# EAGLE design Guitar Hero Controller PS2 to PC PCB (EAGLE 9.2.0)
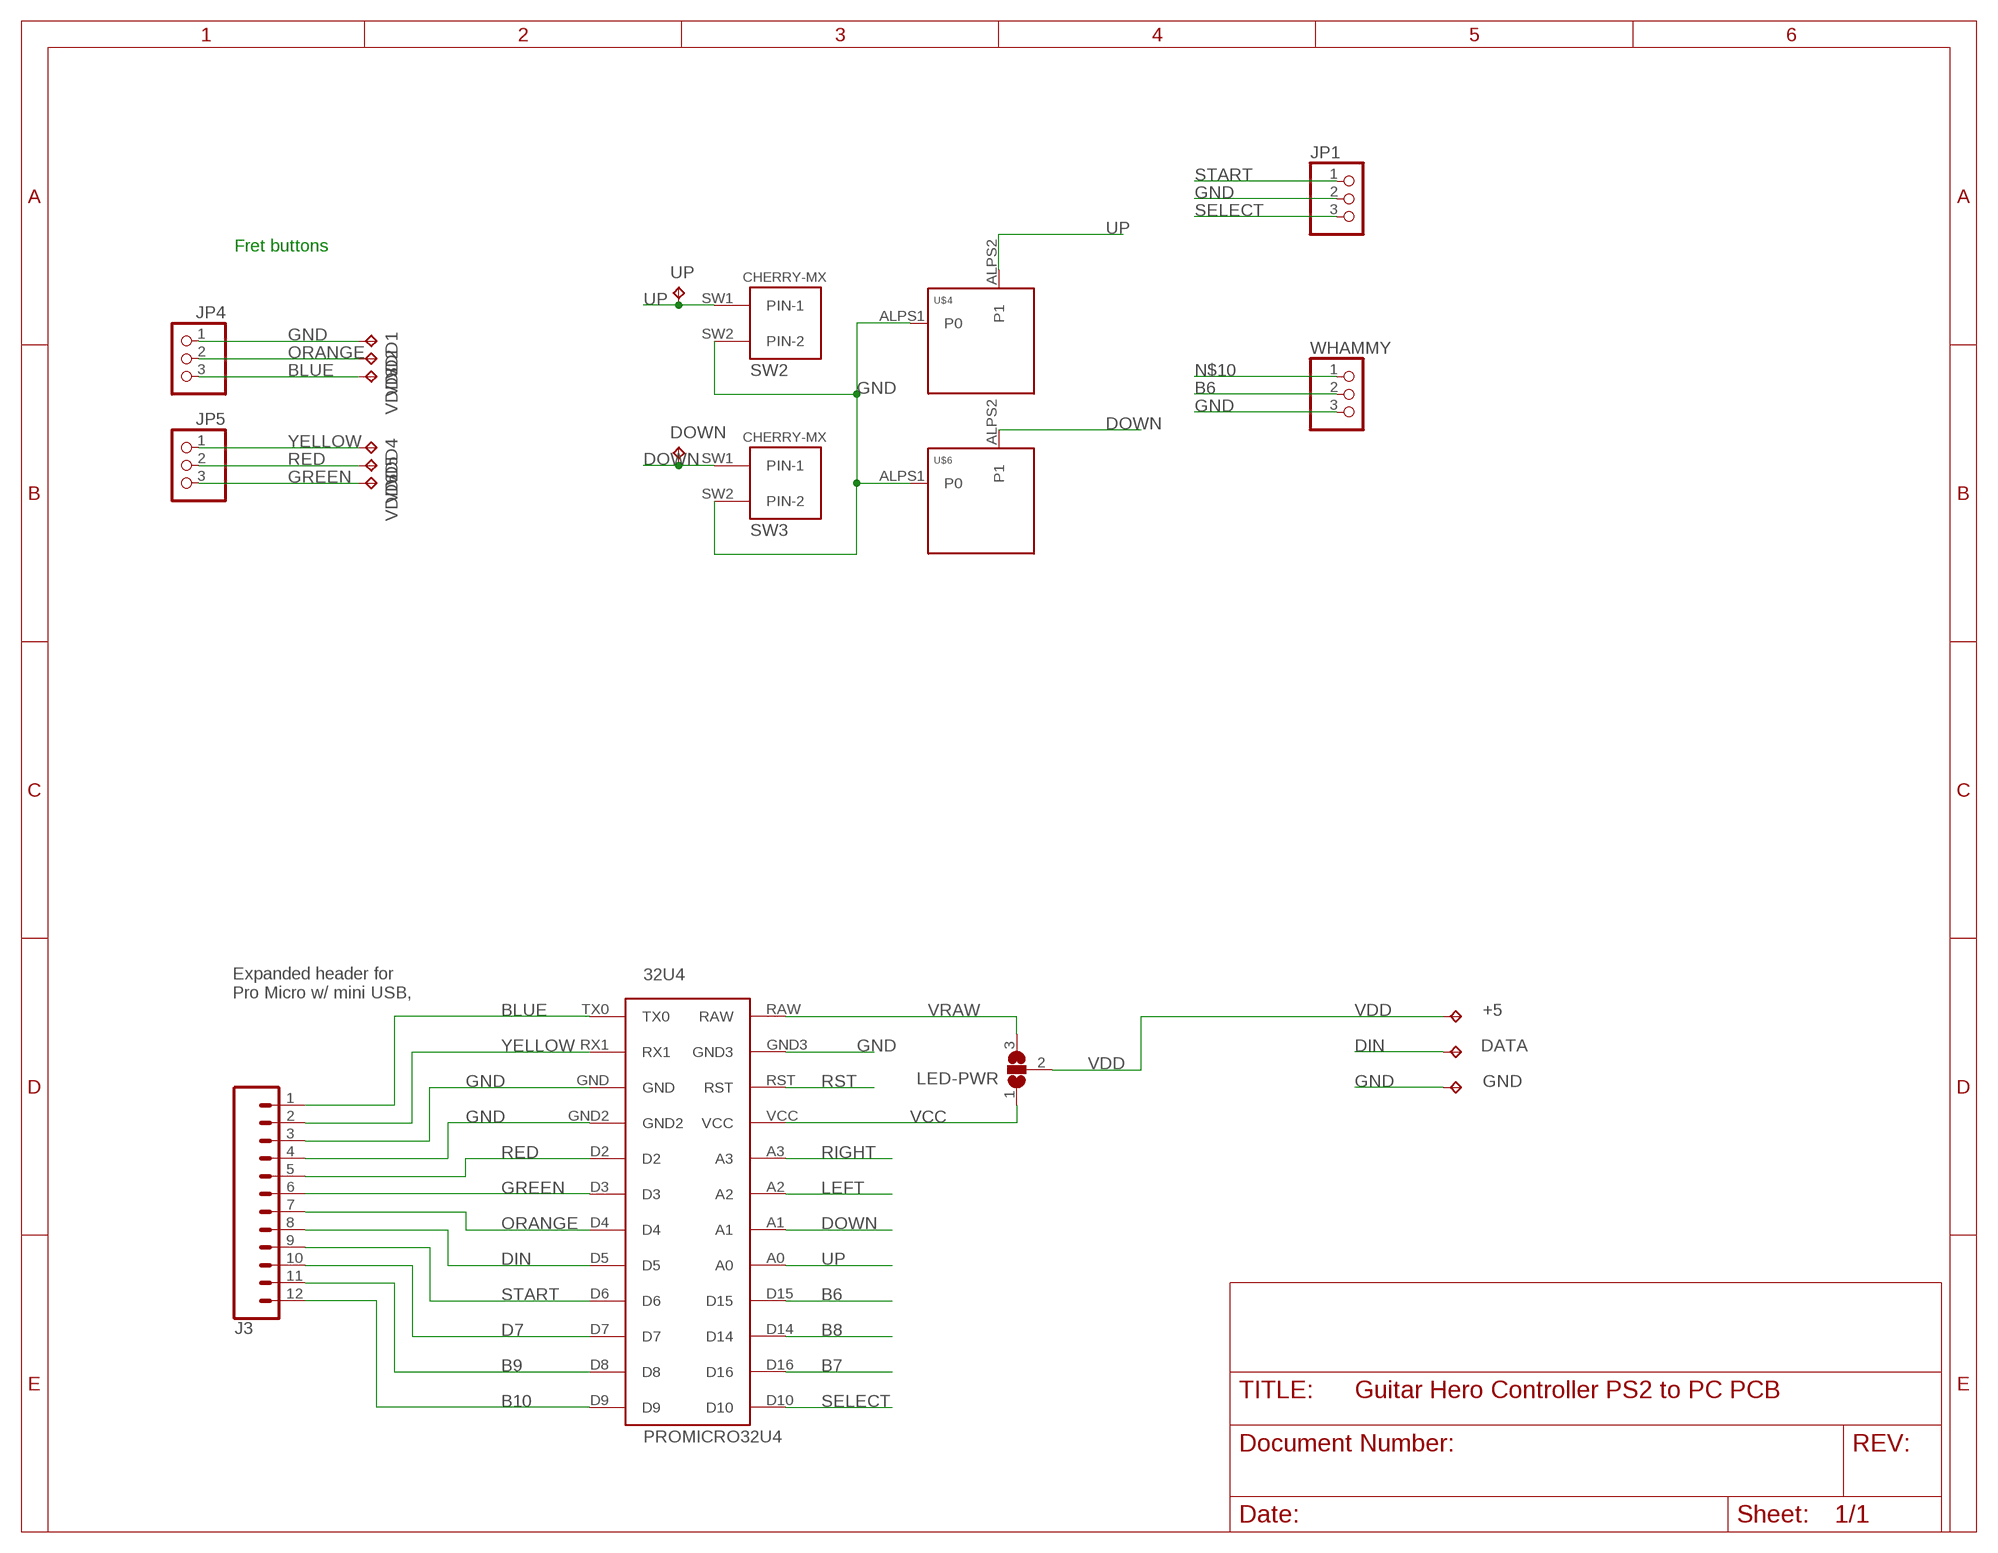
[diagram p0: schematic, sheet 1]

## Parts
32U4  PROMICRO32U4  [PROMICRO32U4]
+5  TPTP20SQ  [TP20SQ]
DATA  TPTP20SQ  [TP20SQ]
DOWN  TPTP20R  [TP20R]
GND  TPTP20SQ  [TP20SQ]
J3  CONN_12NO_SILK  [1X12_NO_SILK]
JP1  PINHD-1X3CB  [1X03-CLEANBIG]
JP4  PINHD-1X3CB  [1X03-CLEANBIG]
JP5  PINHD-1X3CB  [1X03-CLEANBIG]
LED-PWR  SJ2W  [SJ_2]
SW2  CHERRY-MX  [CHERRY-MX]
SW3  CHERRY-MX  [CHERRY-MX]
U$4  KEYSWITCH-PLAIN-ALPS-1U  [ALPS-1U]
U$6  KEYSWITCH-PLAIN-ALPS-1U  [ALPS-1U]
UP  TPTP20R  [TP20R]
VDD1  TPTP20SQ  [TP20SQ]
VDD2  TPTP20SQ  [TP20SQ]
VDD3  TPTP20SQ  [TP20SQ]
VDD4  TPTP20SQ  [TP20SQ]
VDD5  TPTP20SQ  [TP20SQ]
VDD6  TPTP20SQ  [TP20SQ]
WHAMMY  PINHD-1X3CB  [1X03-CLEANBIG]

## Nets
B6: 32U4.D15 WHAMMY.2
B7: 32U4.D16
B8: 32U4.D14
B9: 32U4.D8 J3.11
B10: 32U4.D9 J3.12
BLUE: 32U4.TX0 J3.1 JP4.3 VDD3.TP
D7: 32U4.D7 J3.10
DIN: 32U4.D5 DATA.TP J3.8
DOWN: 32U4.A1 DOWN.TP SW3.SW1(PIN-1) U$6.ALPS2(P1)
GND: 32U4.GND 32U4.GND2 32U4.GND3 GND.TP J3.3 J3.4 JP1.2 JP4.1 SW2.SW2(PIN-2) SW3.SW2(PIN-2) U$4.ALPS1(P0) U$6.ALPS1(P0) VDD1.TP WHAMMY.3
GREEN: 32U4.D3 J3.6 JP5.3 VDD6.TP
LEFT: 32U4.A2
N$10: WHAMMY.1
ORANGE: 32U4.D4 J3.7 JP4.2 VDD2.TP
RED: 32U4.D2 J3.5 JP5.2 VDD5.TP
RIGHT: 32U4.A3
RST: 32U4.RST
SELECT: 32U4.D10 JP1.3
START: 32U4.D6 J3.9 JP1.1
UP: 32U4.A0 SW2.SW1(PIN-1) U$4.ALPS2(P1) UP.TP
VCC: 32U4.VCC LED-PWR.1
VDD: +5.TP LED-PWR.2
VRAW: 32U4.RAW LED-PWR.3
YELLOW: 32U4.RX1 J3.2 JP5.1 VDD4.TP

## Notes on the sheet
- Fret buttons
- Expanded header for 
  Pro Micro w/ mini USB,

## Library data of the parts
32U4 = Pro-micro32u4:PROMICRO32U4
+5 DATA DOWN GND UP VDD1-VDD6 = testpad:TP: Test pad
J3 = SparkFun-Connectors:CONN_12: Multi connection point. Often used as Generic Header-pin footprint for 0.1 inch spaced/style header connections On any of the 0.1 inch spaced packages, you can populate with these: Break Away Headers - Straight <https://www.sparkfun.com/products/116> (PRT-00116) Break Away Male Headers - Right Angle <https://www.sparkfun.com/products/553> (PRT-00553) Female Headers <https://www.sparkfun.com/products/115> (PRT-00115) Break Away Headers - Machine Pin <https://www.sparkfun.com/products/117> (PRT-00117) Break Away Female Headers - Swiss Machine Pin <https://www.sparkfun.com/products/743> (PRT-00743) For SCREWTERMINALS and SPRING TERMINALS visit here: Screw Terimnals on SparkFun.com <https://www.sparkfun.com/search/results?term=Screw+Terminals> (5mm/3.5mm/2.54mm spacing) This device is also useful as a general connection point to wire up your design to another part of your project. Our various solder wires solder well into these plated through hole pads. Hook-Up Wire - Assortment (Stranded, 22 AWG) <https://www.sparkfun.com/products/11375> (PRT-11375) Hook-Up Wire - Assortment (Solid Core, 22 AWG) <https://www.sparkfun.com/products/11367> (PRT-11367) View the entire wire category on our website here <https://www.sparkfun.com/categories/141> Special notes: Molex polarized connector foot print use with SKU : PRT-08231 with associated crimp pins and housings. 1MM SMD Version SKU: PRT-10208 NOTES ON THE VARIANTS LOCK and LOCK_LONGPADS... This footprint was designed to help hold the alignment of a through-hole component (i.e. 6-pin header) while soldering it into place. You may notice that each hole has been shifted either up or down by 0.005 of an inch from it's more standard position (which is a perfectly straight line). This slight alteration caused the pins (the squares in the middle) to touch the edges of the holes. Because they are alternating, it causes a "brace" to hold the component in place. 0.005 has proven to be the perfect amount of "off-center" position when using our standard breakaway headers. Although looks a little odd when you look at the bare footprint, once you have a header in there, the alteration is very hard to notice. Also,if you push a header all the way into place, it is covered up entirely on the bottom side.
JP1 JP4 JP5 WHAMMY = adafruit:PINHD-1X3: PIN HEADER
LED-PWR = jumper:SJ2W: SMD solder JUMPER
SW2 SW3 = cherrymx:CHERRY-MX: Cherry MX series keyswitch
U$4 U$6 = Keyboard:KEYSWITCH-PLAIN

## Net classes
0 vcc: width 0.254 mm, clearance 0.127 mm

## Board
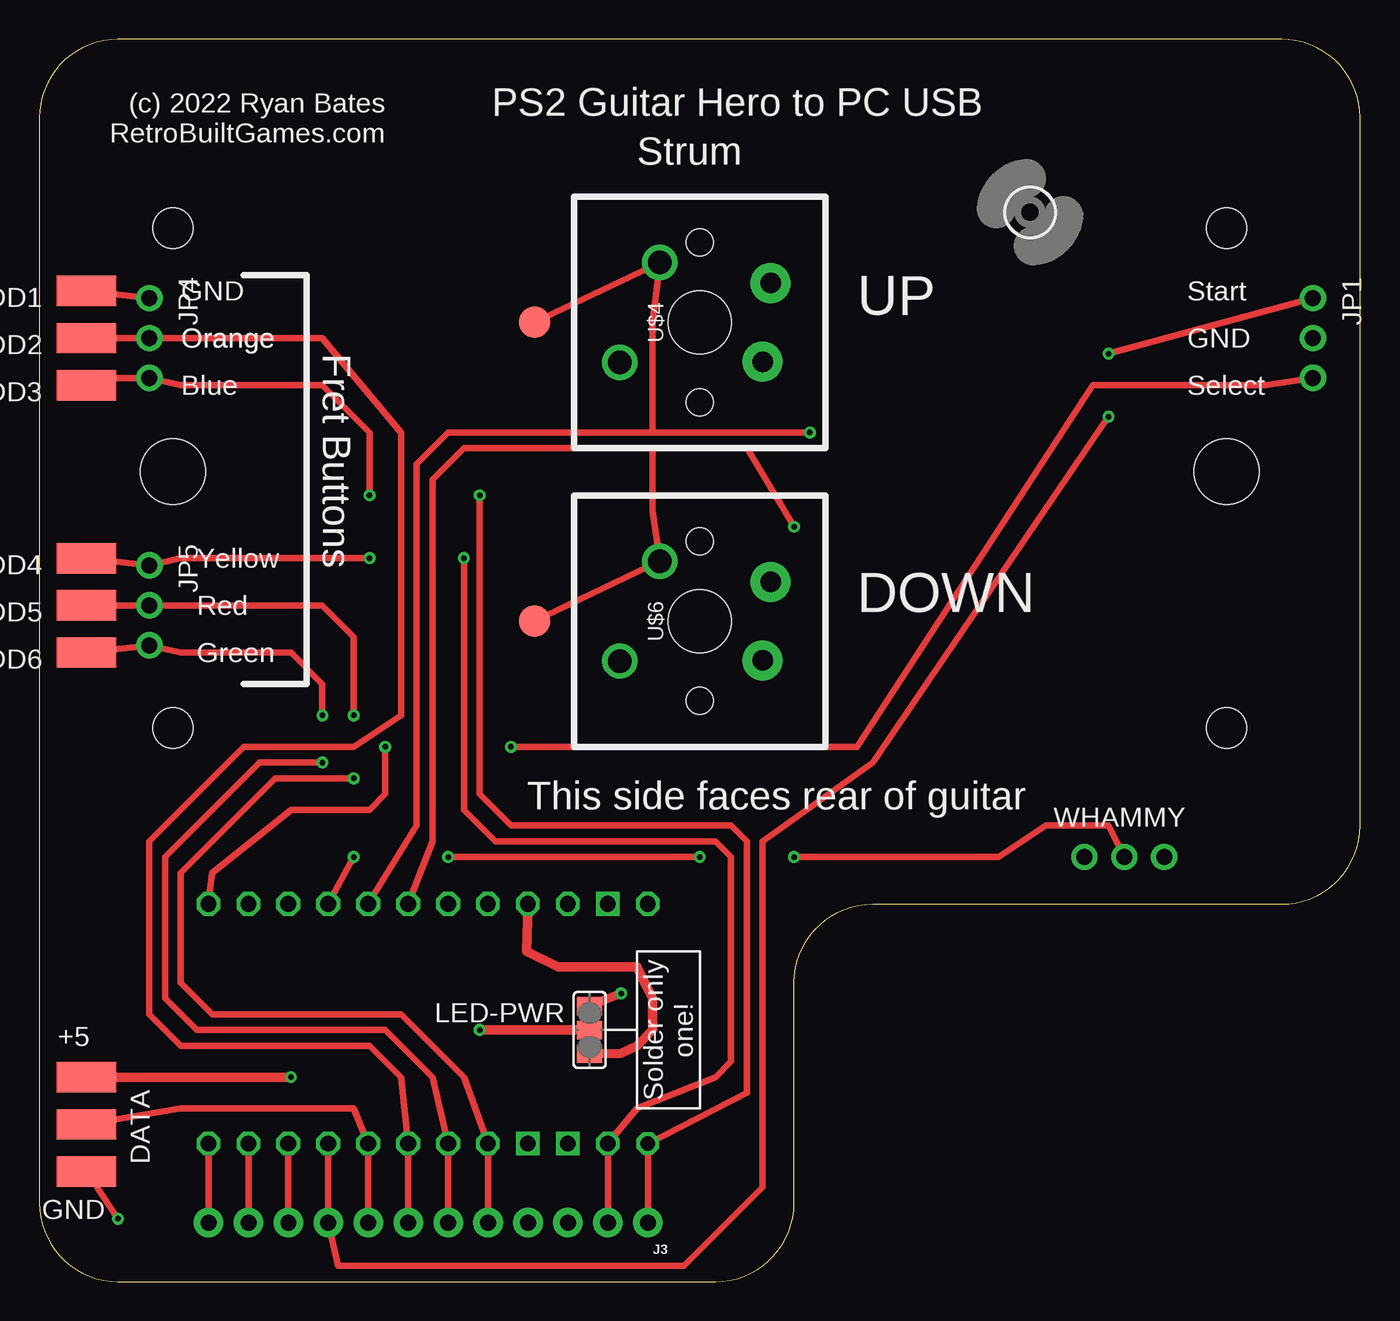
[diagram p1: board, top side]
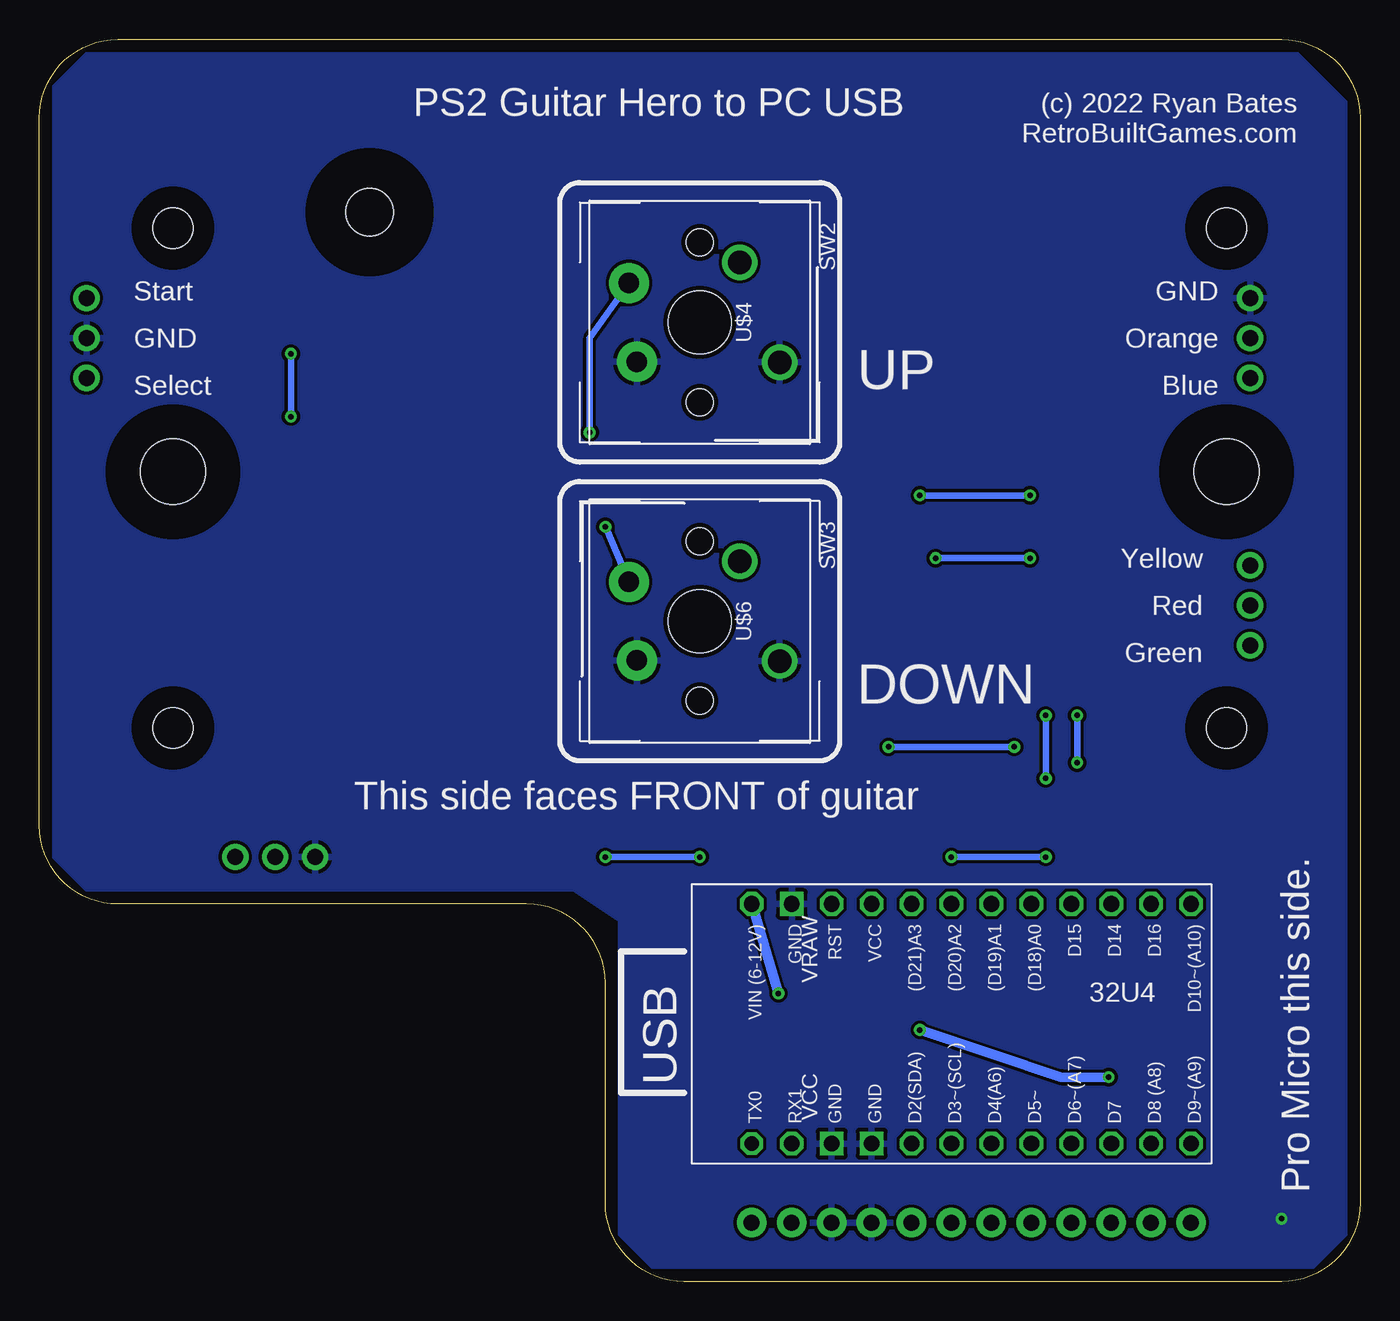
[diagram p2: board, bottom side, seen from below]

Size 84 x 79 mm. Coordinates in mm from the lower left corner, seen from the top.
Outline: 48,5 48,19 arc-90 53,24 79,24 arc90 84,29 84,74 arc90 79,79 5,79 arc90 0,74 0,5 arc90 5,0 43,0 arc90 48,5
Copper layers (1*16): Top 0.035mm / dielectric 1.5mm / Bottom 0.035mm
Design rules "default *": minimum track width 6mil, minimum drill 0.35mm, track to track 8mil, track to pad 8mil, pad to pad 8mil, via to via 10mil, smd to smd 0mil, copper to edge 12mil, drill to drill 12mil, minimum pad ring 10mil, minimum via ring 8mil, stop-mask expansion 4mil, vias tented up to drill 0mil, thermal gap 10mil
Holes 1.71 mm at 42,55.92 42,66.08 42,47.08 42,36.92
Holes 2.56 mm at 8.5,67 8.5,35.2 75.5,35.2 75.5,67
Holes 4.15 mm at 75.5,51.5 8.5,51.5
bRestrict: area 6.5,65 to 10.5,69; area 6.5,33.2 to 10.5,37.2; area 73.5,33.2 to 77.5,37.2; area 73.5,65 to 77.5,69; area 72.5,48.5 to 78.5,54.5; area 5.5,48.5 to 11.5,54.5

### Footprints (pad centres in the part's own frame; a part is rotated, then mirrored left to right if it is on the bottom)
PROMICRO32U4 = drill 1 octagon: A0 16.51,-21.59; A1 16.51,-19.05; A2 16.51,-16.51; A3 16.51,-13.97; D2 1.27,-13.97; D3 1.27,-16.51; D4 1.27,-19.05; D5 1.27,-21.59; D6 1.27,-24.13; D7 1.27,-26.67; D8 1.27,-29.21; D9 1.27,-31.75; D10 16.51,-31.75; D14 16.51,-26.67; D15 16.51,-24.13; D16 16.51,-29.21; RAW 16.51,-3.81; RST 16.51,-8.89; RX1 1.27,-6.35; VCC 16.51,-11.43 | drill 1 square: GND 1.27,-8.89; GND2 1.27,-11.43; GND3 16.51,-6.35 | drill 0.9 octagon: TX0 1.27,-3.81
TP20SQ = smd 3.81 x 1.93: TP 0,0
TP20R = smd 2 x 2: TP 0,0
1X12_NO_SILK = drill 1.016 pad 1.88: 1 0,0; 2 2.54,0; 3 5.08,0; 4 7.62,0; 5 10.16,0; 6 12.7,0; 7 15.24,0; 8 17.78,0; 9 20.32,0; 10 22.86,0; 11 25.4,0; 12 27.94,0
1X03-CLEANBIG = drill 1.016 pad 1.676: 1 -2.54,0; 2 0,0; 3 2.54,0
SJ_2 = smd 1.168 x 1.6: 1 -1.524,0; 2 0,0; 3 1.524,0
CHERRY-MX = drill 1.5 pad 2.184: SW1 -3.81,2.54; SW2 2.54,5.08 | hole 4: 0,0
ALPS-1U = drill 1.3 pad 2.54: ALPS1 -2.5,4; ALPS2 2.5,4.5
3,0 = hole 3: 0,0

### Placement (x,y rotation side)
32U4  42.5,7.5 90 bottom
+5  3,13 0 top
DATA  3,10 0 top
DOWN  31.5,42 270 top
GND  3,7 0 top
J3  38.7,3.75 180 top
JP1  81,60 270 top
JP4  7,60 270 top
JP5  7,43 270 top
LED-PWR  35,16 90 top
SW2  42,61 270 bottom
SW3  42,42 270 bottom
U$4  42,61 90 bottom
U$6  42,42 90 bottom
U$12  [3,0]  63,68 270 top
UP  31.5,61 90 top
VDD1  3,63 0 top
VDD2  3,60 0 top
VDD3  3,57 0 top
VDD4  3,46 0 top
VDD5  3,43 0 top
VDD6  3,40 0 top
WHAMMY  69,27 180 top

### Tracks (layer width: path | path; a pad name or v marks a point on that pad's centre or on a via)
B6  (via drill 0.35)
  Top 0.406: 32U4.D15 v20,27 | v26,27 v42,27 | v48,27 61,27 64,29 68,29 WHAMMY.2
  Bottom 0.406: v20,27 v26,27 | v42,27 v48,27
B9
  Top 0.406: 32U4.D8 J3.11
B10
  Top 0.406: J3.12 32U4.D9
BLUE  (via drill 0.35)
  Top 0.406: VDD3.TP 3.46,57.46 JP4.3 9,57 18,57 21,54 v21,50 | J3.1 32U4.TX0 | 32U4.TX0 | v28,50 28,31 30,29 44,29 45,28 45,12 32U4.TX0
  Bottom 0.406: v21,50 v28,50
D7
  Top 0.406: 32U4.D7 J3.10
DIN
  Top 0.406: J3.8 32U4.D5 20,11 9,11 DATA.TP
DOWN  (via drill 0.35)
  Top 0.406: v48,48 45,53 39,53 | 39,53 27,53 25,51 25,28 32U4.A1 | DOWN.TP SW3.SW1 39,49 39,53
  Bottom 0.406: U$6.ALPS2 v48,48
GND  (via drill 0.35)
  Top 0.406: VDD1.TP JP4.1 | GND.TP v5,4
  pour Bottom: 1,75 4,78 81,78 83,76 83,27 81,25 50,25 47,23 47,3 45,1 3,1 1,3
GREEN  (via drill 0.35)
  Top 0.406: J3.6 32U4.D3 25,13 22,16 10,16 8,18 8,27 14,33 v18,33 | VDD6.TP JP5.3 9,40 16,40 18,38 v18,36
  Bottom 0.406: v18,33 v18,36
ORANGE
  Top 0.406: VDD2.TP JP4.2 18,60 23,54 23,36 20,34 13,34 7,28 7,17 9,15 21,15 23,13 32U4.D4 | 32U4.D4 | 32U4.D4 J3.7
RED  (via drill 0.35)
  Top 0.406: J3.5 32U4.D2 27,13 23,17 11,17 9,19 9,26 15,32 v20,32 | VDD5.TP JP5.2 18,43 20,41 v20,36
  Bottom 0.406: v20,32 v20,36
SELECT  (via drill 0.35)
  Top 0.406: 32U4.D10 11,26 16,30 21,30 22,31 v22,34 | v30,34 52,34 67,57 78,57 JP1.3
  Bottom 0.406: v22,34 v30,34
START  (via drill 0.35)
  Top 0.406: 32U4.D6 J3.9 19,1 41,1 46,6 46,28 53,33 v68,55 | v68,59 79,62 JP1.1
  Bottom 0.406: v68,55 v68,59
UP  (via drill 0.35)
  Top 0.406: 32U4.A0 24,29 24,52 26,54 39,54 | 39,54 v49,54 | UP.TP SW2.SW1 39,61 39,54
  Bottom 0.406: v49,54 49,60 U$4.ALPS2
VCC
  Top 0.61: 32U4.VCC 31,21 33,20 38,20 39,18 39,16 38,15 37,14.5 LED-PWR.1
VDD  (via drill 0.35)
  Top 0.61: LED-PWR.2 v28,16 | v16,13 +5.TP
  Bottom 0.61: v28,16 19,13 v16,13
VRAW  (via drill 0.35)
  Top 0.61: LED-PWR.3 v37,18.32
  Bottom 0.61: v37,18.32 32U4.RAW
YELLOW  (via drill 0.35)
  Top 0.406: J3.2 32U4.RX1 38,11 43,13 44,14 44,27 43,28 29,28 27,30 v27,46 | v21,46 9,46 JP5.1 VDD4.TP
  Bottom 0.406: v27,46 v21,46

### Text on the board
tPlace: PS2 Guitar Hero to PC USB | (c) 2022 Ryan Bates / RetroBuiltGames.com | Strum | GND | Start | Orange | Orange | GND | Fret Buttons | Blue | Select | Yellow | Red | Green | This side faces rear of guitar | Solder only / one!
bPlace: PS2 Guitar Hero to PC USB | (c) 2022 Ryan Bates / RetroBuiltGames.com | GND | Start | Orange | GND | UP | Blue | Select | Yellow | Red | Green | DOWN | This side faces FRONT of guitar | Pro Micro this side. | VRAW | USB | VCC